# Altium schematic sheet POWER.SchDoc (part 3 of 3)
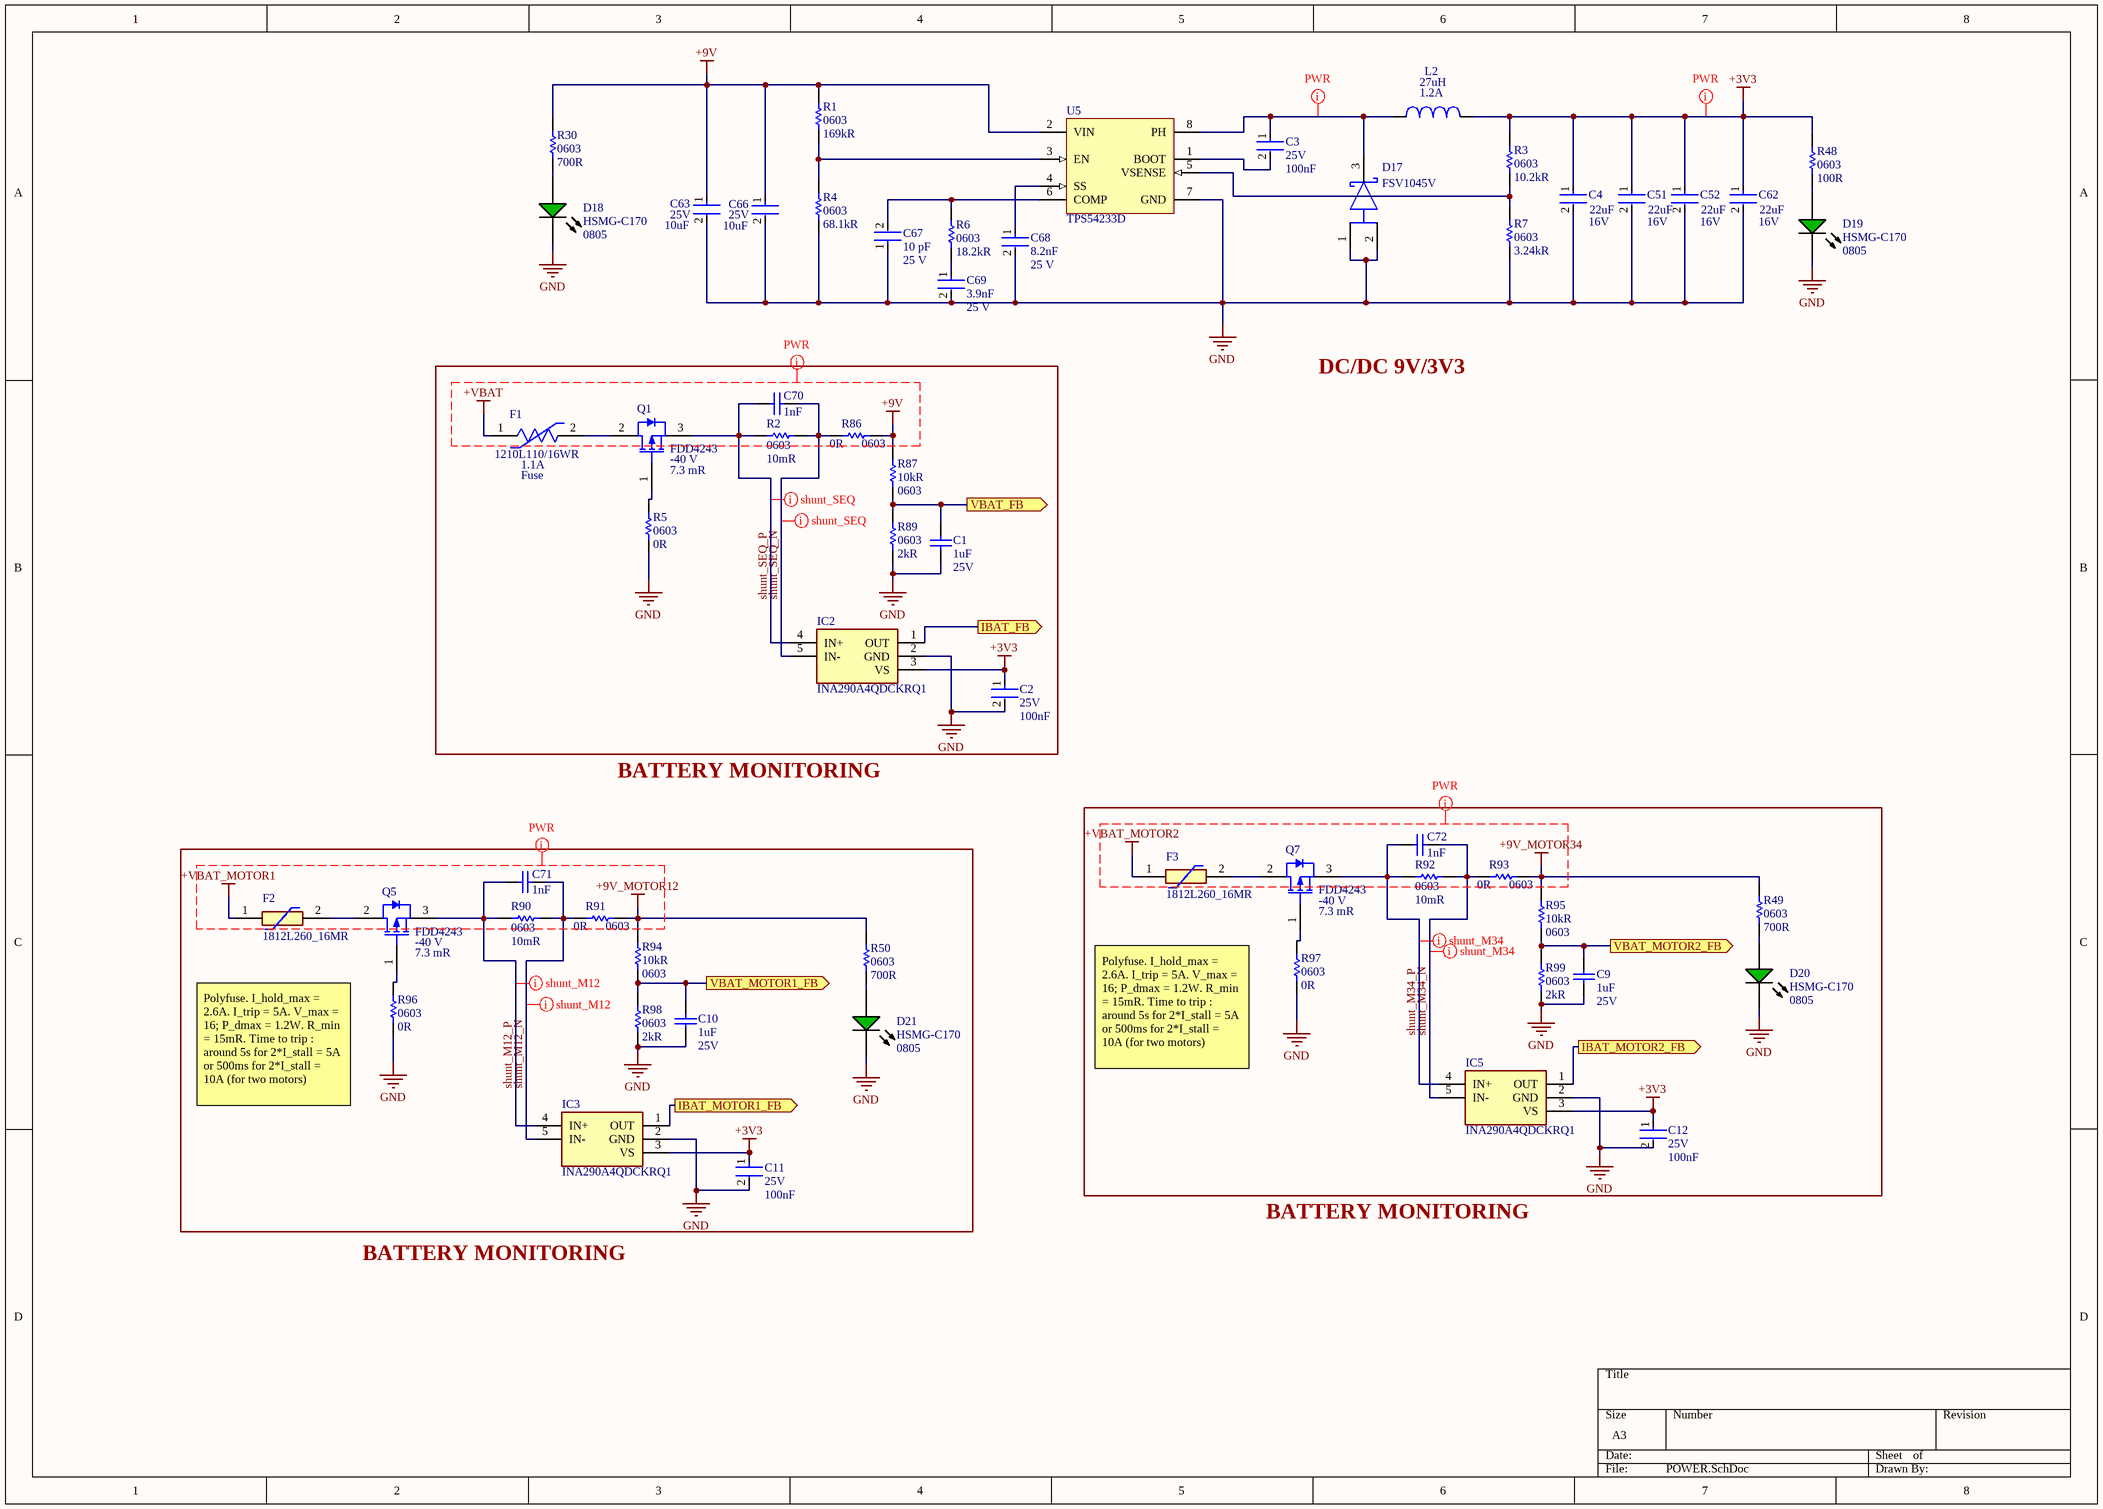
[diagram p2: POWER.SchDoc]

## Library data of the parts (continued)
U5 = CMP-0323-00196-3: Buck Step Down Regulator with 3.5 to 28 V Input and 0.8 to 25 V Output, -40 to 150 degC, 8-Pin SOIC (D), Green (RoHS & no Sb/Br); Manufacturer: Texas Instruments; Iq(Typ)(mA): 0.11; Vout(Max)(V): 25; SubFamily: Step-Down Regulator; Rating: Catalog; Regulated Outputs(#): 1; Duty Cycle(Max)(%): 90; Vout(Min)(V): 0.8; Iout(Max)(A): 2; Vin(Min)(V): 3.5; Vin(Max)(V): 28; Switch Current Limit(Typ)(A): 2.3; PackageVersion: revM, Jun-2011; Mounting Technology: Surface Mount; PartNumber: TPS54233D; PackageDescription: 8-Pin Plastic Small Outline Integrated Circuit, 4.9 x 3.9 mm, Pitch 1.27 mm Pitch; Eco-Plan: Green (RoHS & no Sb/Br); ComponentLink1Description: Datasheet; ComponentLink2Description: Package Specification; Topology: Buck; ComponentLink2URL: http://www.ti.com/litv/pdf/msoi002j; ComponentLink1URL: http://www.ti.com/general/docs/lit/getliterature.tsp?genericPartNumber=TPS54233&fileType=pdf; Code_JEDEC: MS-012AA; DatasheetVersion: SLUS859B; ComponentLink3URL: Samples URL:http://www.ti.com/product/tps54233#samples; PackageReference: D0008A; ComponentLink3Description: URL Link1